# Altium schematic sheet Microcontroller.SchDoc
size A; SheetNumber: 1; SheetTotal: 8
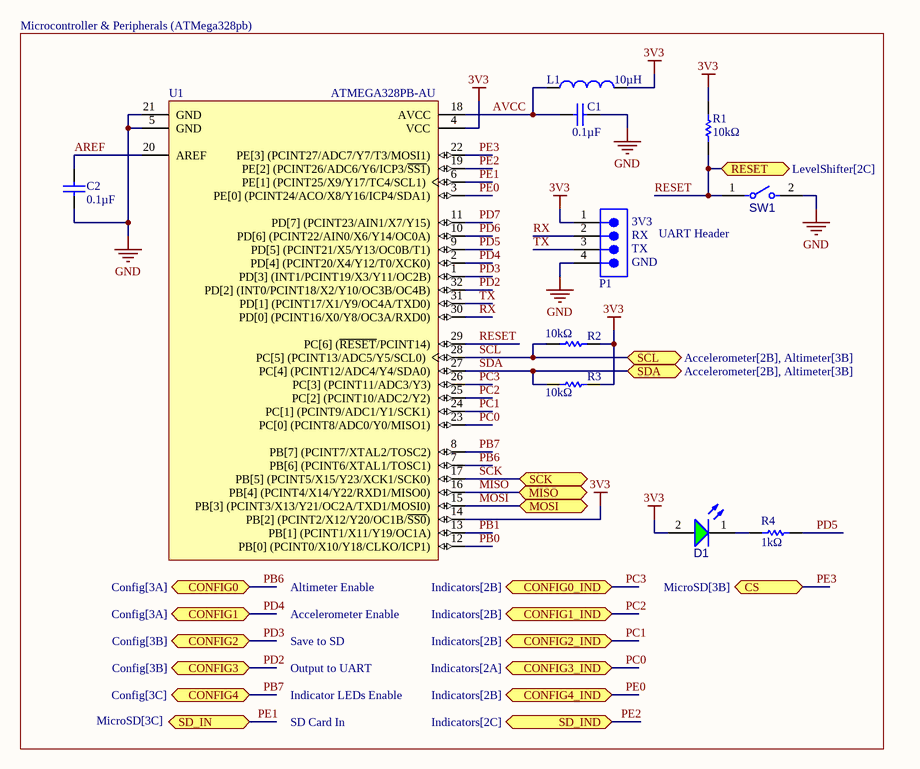
[diagram p0: Microcontroller.SchDoc]

## Parts
C1  0.1µF  [CAPC3216X100X50LL20T25]
C2  0.1µF  [CAPC3216X100X50LL20T25]
D1  150120GS75000  [WL-SMCW_1206_150120xx75000]  (value not drawn)
L1  10µH  [WE-MI_1206_L3.2W1.6H1.1]
P1  61300411121  [61300411121]  (value not drawn)
R1  10kΩ  [RESC3116X65X40LL10T20]
R2  10kΩ  [RESC3116X65X40LL10T20]
R3  10kΩ  [RESC3116X65X40LL10T20]
R4  1kΩ  [RESC3116X65X40LL10T20]
SW1  RST  [FP-B3U-1000P-B-MFG]  (value not drawn)
U1  ATMEGA328PB-AU  [ATML-32A_L]

## Ports
CONFIG0 (bidir, see Config[3A]), CONFIG0_IND (bidir, see Indicators[2B]), CONFIG1 (bidir, see Config[3A]), CONFIG1_IND (bidir, see Indicators[2B]), CONFIG2 (bidir, see Config[3B]), CONFIG2_IND (bidir, see Indicators[2B]), CONFIG3 (bidir, see Config[3B]), CONFIG3_IND (bidir, see Indicators[2A]), CONFIG4 (bidir, see Config[3C]), CONFIG4_IND (bidir, see Indicators[2B]), CS (bidir, see MicroSD[3B]), MISO (bidir, see LevelShifter[4C], MicroSD[3B]), MOSI (bidir, see LevelShifter[2B], MicroSD[3B]), RESET (bidir, see LevelShifter[2C]), SCK (bidir, see LevelShifter[2C], MicroSD[3B]), SCL (bidir, see Accelerometer[2B], Altimeter[3B]), SD_IN (bidir, see MicroSD[3C]), SD_IND (bidir, see Indicators[2C]), SDA (bidir, see Accelerometer[2B], Altimeter[3B])

## Nets
3V3: D1.2(A) L1.2 P1.1 R1.2 R2.2 R3.2 U1.4(VCC) U1.14(PB[2]_(PCINT2/X12/Y20/OC1B/~{SS0}))
GND: C1.1 C2.2 P1.4 SW1.2 U1.5(GND) U1.21(GND)
AREF: C2.1 U1.20(AREF)
AVCC: C1.2 L1.1 U1.18(AVCC)
MISO: U1.16(PB[4]_(PCINT4/X14/Y22/RXD1/MISO0)) ; port MISO
MOSI: U1.15(PB[3]_(PCINT3/X13/Y21/OC2A/TXD1/MOSI0)) ; port MOSI
PB0: U1.12(PB[0]_(PCINT0/X10/Y18/CLKO/ICP1))
PB1: U1.13(PB[1]_(PCINT1/X11/Y19/OC1A))
PB6: U1.7(PB[6]_(PCINT6/XTAL1/TOSC1)) ; port CONFIG0
PB7: U1.8(PB[7]_(PCINT7/XTAL2/TOSC2)) ; port CONFIG4
PC0: U1.23(PC[0]_(PCINT8/ADC0/Y0/MISO1)) ; port CONFIG3_IND
PC1: U1.24(PC[1]_(PCINT9/ADC1/Y1/SCK1)) ; port CONFIG2_IND
PC2: U1.25(PC[2]_(PCINT10/ADC2/Y2)) ; port CONFIG1_IND
PC3: U1.26(PC[3]_(PCINT11/ADC3/Y3)) ; port CONFIG0_IND
PD2: U1.32(PD[2]_(INT0/PCINT18/X2/Y10/OC3B/OC4B)) ; port CONFIG3
PD3: U1.1(PD[3]_(INT1/PCINT19/X3/Y11/OC2B)) ; port CONFIG2
PD4: U1.2(PD[4]_(PCINT20/X4/Y12/T0/XCK0)) ; port CONFIG1
PD5: R4.1 U1.9(PD[5]_(PCINT21/X5/Y13/OC0B/T1))
PD6: U1.10(PD[6]_(PCINT22/AIN0/X6/Y14/OC0A))
PD7: U1.11(PD[7]_(PCINT23/AIN1/X7/Y15))
PE0: U1.3(PE[0]_(PCINT24/ACO/X8/Y16/ICP4/SDA1)) ; port CONFIG4_IND
PE1: U1.6(PE[1]_(PCINT25/X9/Y17/TC4/SCL1)) ; port SD_IN
PE2: U1.19(PE[2]_(PCINT26/ADC6/Y6/ICP3/~{SS1})) ; port SD_IND
PE3: U1.22(PE[3]_(PCINT27/ADC7/Y7/T3/MOSI1)) ; port CS
RESET: R1.1 SW1.1 U1.29(PC[6]_(~{RESET}/PCINT14)) ; port RESET
RX: P1.2 U1.30(PD[0]_(PCINT16/X0/Y8/OC3A/RXD0))
SCK: U1.17(PB[5]_(PCINT5/X15/Y23/XCK1/SCK0)) ; port SCK
SCL: R2.1 U1.28(PC[5]_(PCINT13/ADC5/Y5/SCL0)) ; port SCL
SDA: R3.1 U1.27(PC[4]_(PCINT12/ADC4/Y4/SDA0)) ; port SDA
TX: P1.3 U1.31(PD[1]_(PCINT17/X1/Y9/OC4A/TXD0))
NetD1_1: D1.1(K) R4.2

## Notes on the sheet
- Microcontroller & Peripherals (ATMega328pb)
- (near P1) 3V3
- (near P1) TX
- (near P1) RX
- (near P1) GND
- UART Header
- (near U1) Altimeter Enable
- Accelerometer Enable
- Save to SD
- Output to UART
- Indicator LEDs Enable
- SD Card In

## Library data of the parts
C1 C2 = CMP-1664-00001-4: Chip Capacitor, 100 nF, +/- 10%, 25 V, -55 to 125 degC, 1206 (3216 Metric), RoHS, Tape and Reel; Manufacturer: Kemet; Voltage Rating: 25 V; ComponentLink1URL: http://www.kemet.com/; Max Operating Temperature: 125 degC; PackageReference: 1206; ComponentLink2URL: http://www.kemet.com/docfinder?Partnumber=C1206F104K3RACTU; ComponentLink1Description: Manufacturer URL; ComponentLink2Description: Datasheet; Length: 3.2 mm; Packaging: Tape and Reel; Height: 0.78 mm; Mounting Technology: Surface Mount; REACH SVHC: No SVHC; PackageDescription: 2-Pin Surface Mount Device, Body 3.2 x 1.6 mm; Min Operating Temperature: -55 degC; RoHSCompliant: true; DatasheetVersion: 02/2016; Package Quantity: 4000
D1 = CMP-1426-00014-4: WL-SMCW SMT Mono-Color Chip LED Waterclear; Dominant Wavelength: 525nm; Reverse Voltage: 5V; Max Junction Temperature (Tj): 95°C; Lens Style: Clear, Rectangular; Forward Voltage: 3.2V; Power Dissipation: 105mW; Peak Wavelength: 515nm; Test Current: 20mA; Color: Green; Forward Current: 100mA; Luminous Intensity: 450mcd; Viewing Angle: 140°; Case Code (Imperial): 1206; REACH SVHC: Unknown; Packaging: Tape and Reel; Max Operating Temperature: 85°C; Case/Package: 1206; Height: 680µm; Length: 3.2mm; Mount: Surface Mount; Min Operating Temperature: -40°C; Width: 1.6mm; Case Code (Metric): 3216; Max Reverse Voltage (DC): 5V; RoHS: Compliant; Wavelength: 525nm
L1 = CMP-0221-00030-2: NexarPartId: 23259292; Max DC Current: 25mA; Inductance Tolerance: 10%; Core Material: Ferrite; Shielding: Unshielded; DC Resistance (DCR): 500mΩ; Self Resonant Frequency: 26MHz; Ambient Temperature Range Low: -55°C; RoHS: Compliant; Inductance: 10µH; Tolerance: 10%; Length: 3.2mm; Width: 1.6mm; Case/Package: SMD/SMT; Min Operating Temperature: -55°C; Ambient Temperature Range High: 85°C; Depth: 1.6mm; Current Rating: 25mA; Max Operating Temperature: 125°C; Height: 1.1mm
P1 = 61300411121: WR-PHD Pin Header, THT, Vertical, pitch 2.54mm, 1 Row, 4P; Manufacturer: Wurth Elektronik; Contact Resistance: 20mOhm; Rated Current: 3A; Working Voltage: 250V; Withstanding Voltage: 500V; Manufacturer Part Number: 61300411121; Category: Board-to-Board Connectors; Match Code: WR-PHD; ComponentLink1Description: Website Link; ComponentLink1URL: https://www.we-online.com/redexpert/article/61300411121?ad; ComponentLink2Description: Datasheet Link; ComponentLink2URL: https://www.we-online.com/redexpert/spec/61300411121?ad; Mount: Through Hole; Operating Temperature Max: 105°C; Operating Temperature Min: -40°C; Packaging: Bag; Gender: Pin Header; Number of Pins: 4; Number of Rows: 1; Orientation: Vertical; Pitch: 2.54mm
R1-R3 = CMP-1014-00623-2: Chip Resistor, 10 KOhm, +/- 1%, 0.25 W, -55 to 155 degC, 1206 (3216 Metric), RoHS, Tape and Reel; Manufacturer: Yageo; Voltage Rating: 200V; Resistance: 10KOhm; Temperature Coefficient: 100ppm/degreesC; Power Rating: 250mW; Packaging: TapeandReel; Termination: SMD/SMT; REACH SVHC: Unknown; Tolerance: 1%; Height: 0.55mm; Composition: ThickFilm; Max Operating Temperature: 155degC; Datasheet Version: Rev. 5, 10/2016; Lead Free: LeadFree; Case Code (Metric): 3216; Depth: 1.6mm; Package Quantity: 5000; RoHSCompliant: true; Military Standard: Not; Case/Package: 1206; Case Code (Imperial): 1206; Min Operating Temperature: -55degC; Datasheet URL: http://www.yageo.com/NewPortal/yageodocoutput?fileName=/pdf/R-Chip/PYu-RC_Group_51_RoHS_L_5.pdf; Length: 3.1mm; Manufacturer URL: http://www.yageo.com/; Package Reference: 1206.0; Width: 1.6mm; Package Description: 2-Pin Surface Mount Device, Body 3.1 x 1.6 mm
R4 = CMP-2100-03678-1: Chip Resistor, 1 KOhm, +/- 1%, 0.25 W, -55 to 155 degC, 1206 (3216 Metric), RoHS, Tape and Reel; Manufacturer: Yageo; Temperature Coefficient: 100ppm/degreesC; Power Rating: 250mW; Voltage Rating: 200V; Resistance: 1KOhm; Composition: ThickFilm; Min Operating Temperature: -55degC; Tolerance: 1%; REACH SVHC: Unknown; Case Code (Metric): 3216; Military Standard: Not; Datasheet Version: Rev. 5, 10/2016; Package Reference: 1206.0; Case/Package: 1206; Length: 3.1mm; Manufacturer URL: http://www.yageo.com/; Lead Free: LeadFree; RoHSCompliant: true; Termination: SMD/SMT; Packaging: TapeandReel; Package Description: 2-Pin Surface Mount Device, Body 3.1 x 1.6 mm; Depth: 1.6mm; Case Code (Imperial): 1206; Max Operating Temperature: 155degC; Datasheet URL: http://www.yageo.com/NewPortal/yageodocoutput?fileName=/pdf/R-Chip/PYu-RC_Group_51_RoHS_L_5.pdf; Height: 0.55mm
SW1 = CMP-08834-000005-1: SWITCH TACTILE SPST-NO 0.05A 12V; Manufacturer Part Number: B3U-1000P-B; Manufacturer: Omron; Operating Force: 1.5N; Contact Current Rating: 50mA; Contact Resistance: 100mΩ; Electromechanical Life: 200000Cycles; Height: 1.75mm; Device Class L2: Switches; Temperature Range High: +70°C; Digikey Description: SWITCH TACTILE SPST-NO 0.05A 12V; Throw Configuration: SPST-NO; Ambient Temperature Range High: +70°C; Temperature: -25°C to +70°C; Lead Free: Yes; ComponentLink2URL: https://omronfs.omron.com/en_US/ecb/products/pdf/en-b3u.pdf; Device Class L3: Tactile Switches; Ambient Temperature Range Low: -25°C; Mount: Surface Mount; Automotive: No; Mouser Description: Tactile Switches Top Actuated with boss w/o ground; Octopart: https://octopart.com/b3u-1000p-b-omron-1057356; RoHS: TRUE; Package: 0; Device Class L1: Electromechanical; Voltage Rating Dc: 12V; Category: Switch; Temperature Range Low: -25°C; ComponentLink2Description: Datasheet
U1 = CMP-2000-07439-1: AVR Microcontroller, 1.8 to 5.5 V, 32 KB Flash, 1 KB EEPROM, 2 KB SRAM, -40 to 85 degC, 32-Pin TQFP (32A), RoHS, Tray; Manufacturer: Microchip; Datasheet URL: http://ww1.microchip.com/downloads/en/DeviceDoc/40001906A.pdf; Mounting Technology: SurfaceMount; RoHSCompliant: false; Manufacturer URL: http://www.microchip.com/; Package Description: 32-Pin Thin Profile Plastic Quad Flat Package, Body 7 x 7 mm, Pitch 0.8 mm; Package Reference: 32A; Datasheet Version: Rev. A, 04/2017